# Altium project PCB_Project.PrjPcb
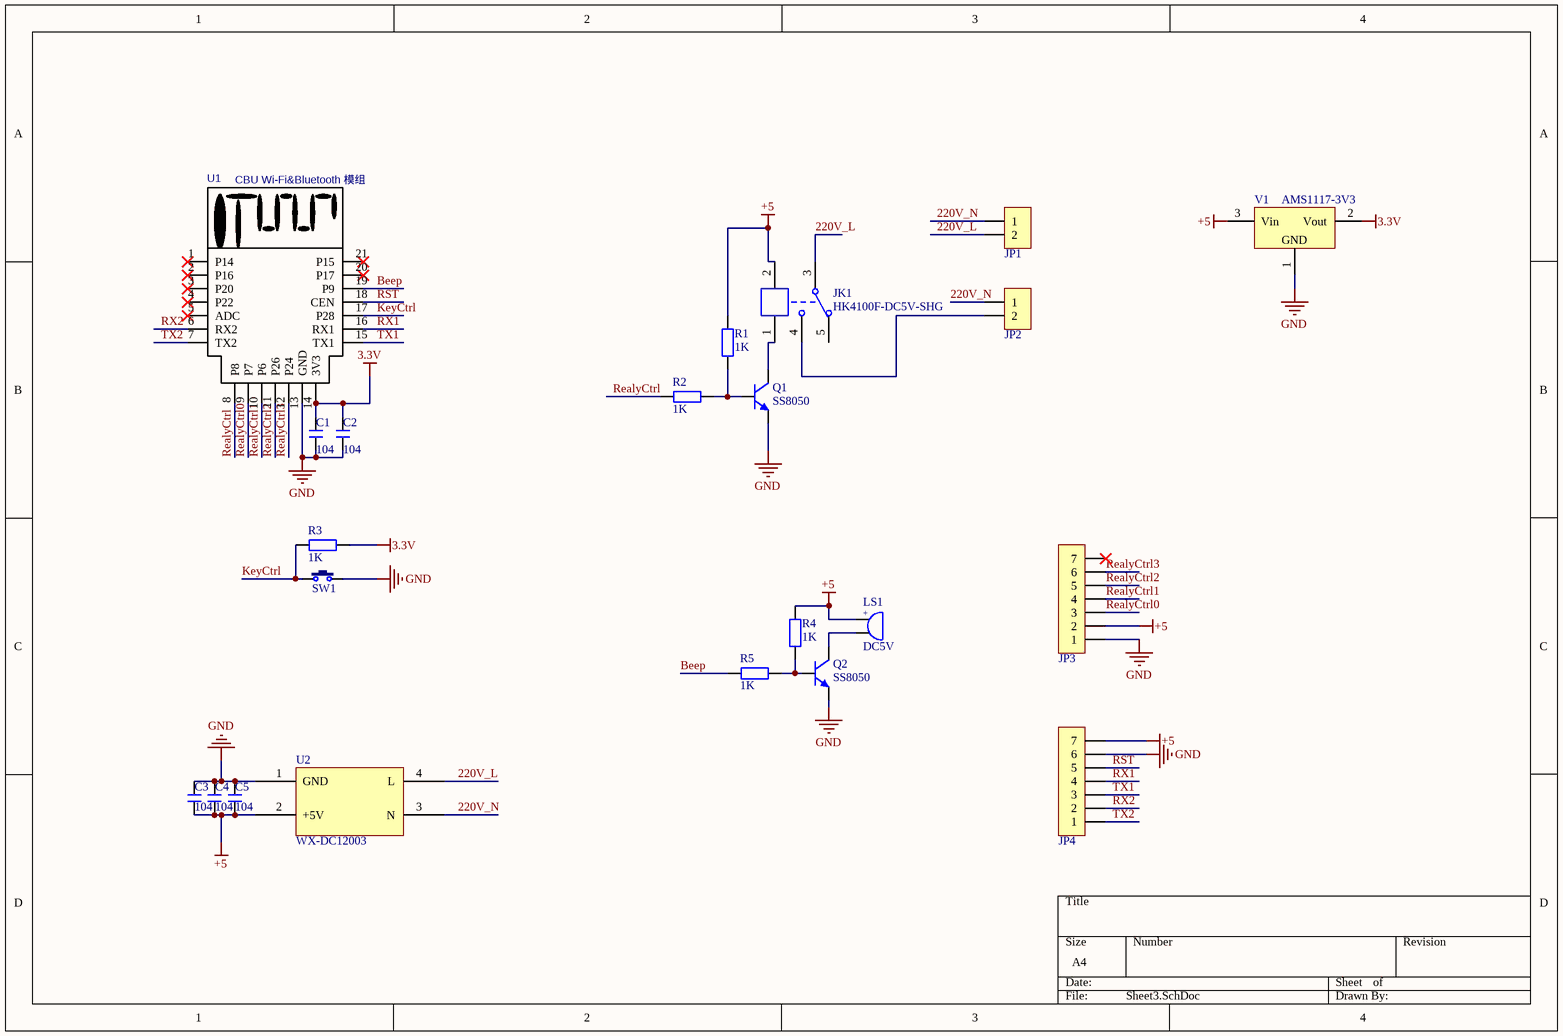
[diagram p0: Sheet3.SchDoc]
1 sheet, 22 parts. Net scope: global (net labels, ports and power ports of the same name join across sheets).
Board file: PCB4.PcbDoc

## Sheet Sheet3.SchDoc
size A4; SheetNumber: 1; SheetTotal: 1

### Parts
C1  104  [C 0805_M]
C2  104  [C 0805_M]
C3  104  [C 0805_M]
C4  104  [C 0805_M]
C5  104  [C 0805_M]
JK1  HK4100F-DC5V-SHG  [HK4100F]
JP1  HDR-1X2  [KF128-3.81-2P]  (value not drawn)
JP2  HDR-1X2  [KF128-3.81-2P]  (value not drawn)
JP3  HDR-1X7  [HDR2.54-M-LI-7P]  (value not drawn)
JP4  HDR-1X7  [HDR2.54-M-LI-7P]  (value not drawn)
LS1  DC5V  [BEEP 7.6X12X7.5]
Q1  SS8050  [SOT23-3M]
Q2  SS8050  [SOT23-3M]
R1  1K  [R 0805_M]
R2  1K  [R 0805_M]
R3  1K  [R 0805_M]
R4  1K  [R 0805_M]
R5  1K  [R 0805_M]
SW1  3x6x5  [TSW SMD-3*6*2.5]  (value not drawn)
U1  CBU Wi-Fi&Bluetooth 模组  [CBU WIFI&BLUETOOTH]
U2  WX-DC12003  [WX-DC12003]
V1  AMS1117-3V3  [SOT223_L]

### Nets
3.3V: C1.2 C2.2 R3.1 U1.14(3V3) V1.2(Vout)
+5: C3.1 C4.1 C5.1 JK1.2 JP3.2 JP4.7 LS1.1 R1.2 R4.2 U2.2(+5V) V1.3(Vin)
GND: C1.1 C2.1 C3.2 C4.2 C5.2 JP3.1 JP4.6 Q1.2(E) Q2.2(E) SW1.2 U1.13(GND) U2.1(GND) V1.1(GND)
220V_L: JK1.3 JP1.2 U2.4(L)
220V_N: JP1.1 JP2.1 U2.3(N)
Beep: R5.1 U1.19(P9)
KeyCtrl: R3.2 SW1.1 U1.17(P28)
RealyCtrl: R2.1 U1.8(P8)
RealyCtrl0: JP3.3 U1.9(P7)
RealyCtrl1: JP3.4 U1.10(P6)
RealyCtrl2: JP3.5 U1.11(P26)
RealyCtrl3: JP3.6 U1.12(P24)
RST: JP4.5 U1.18(CEN)
RX1: JP4.4 U1.16(RX1)
RX2: JP4.2 U1.6(RX2)
TX1: JP4.3 U1.15(TX1)
TX2: JP4.1 U1.7(TX2)
NetJK1_1: JK1.1 Q1.3(C)
NetJK1_4: JK1.4 JP2.2
NetLS1_2: LS1.2 Q2.3(C)
NetQ1_1: Q1.1(B) R1.1 R2.2
NetQ2_1: Q2.1(B) R4.1 R5.2

Not connected (* = marked no-connect by the designer): JK1 5; JP3 7*; U1 1(P14)* 2(P16)* 3(P20)* 4(P22)* 5(ADC)* 20(P17)* 21(P15)*

### Notes on the sheet
- (in symbol BEEP) +

### Library data of the parts
C1-C5 = C: 无极性贴片电容; 版权归属: 源创客; BOM名称: 无极性贴片电容; 学习资源: www.ooocke.com
JK1 = HK4100F: 一组转换; BOM名称: 一组继电器; 版权归属: 源创客; 学习资源: www.ooocke.com
JP1 JP2 = Header 2: 2P接插件; 版权归属: 源创客; BOM名称: 2P接插件; 学习资源: www.ooocke.com
JP3 JP4 = Header 7: 7P接插件; 版权归属: 源创客; BOM名称: 7P接插件; 学习资源: www.ooocke.com
LS1 = BEEP: 蜂鸣器; 版权归属: 源创客; BOM名称: 蜂鸣器; 学习资源: www.ooocke.com
Q1 Q2 = 8050-SMD: 高频放大-NPN型; 版权归属: 源创客; 属性: 40V 1.5A 1W 100MHZ; BOM名称: 高频放大-NPN型; 学习资源: www.ooocke.com
R1-R5 = R: 贴片电阻; 版权归属: 源创客; BOM名称: 贴片电阻; 学习资源: www.ooocke.com
SW1 = TSW 3x6: 3x6轻触开关; 版权归属: 源创客; BOM名称: 3x6轻触开关; 学习资源: www.ooocke.com
U1 = CBU: Contributor: chenlf; BOM_Supplier: Tuya; spicePre: U; spiceSymbolName: CBU Wi-Fi&amp;Bluetooth 模组
U2 = WX-DC12003: wx-DC12003 220V转5V模块
V1 = AMS1117: 三端稳压芯片; BOM名称: 稳压芯片; 版权归属: 源创客; 学习资源: www.ooocke.com